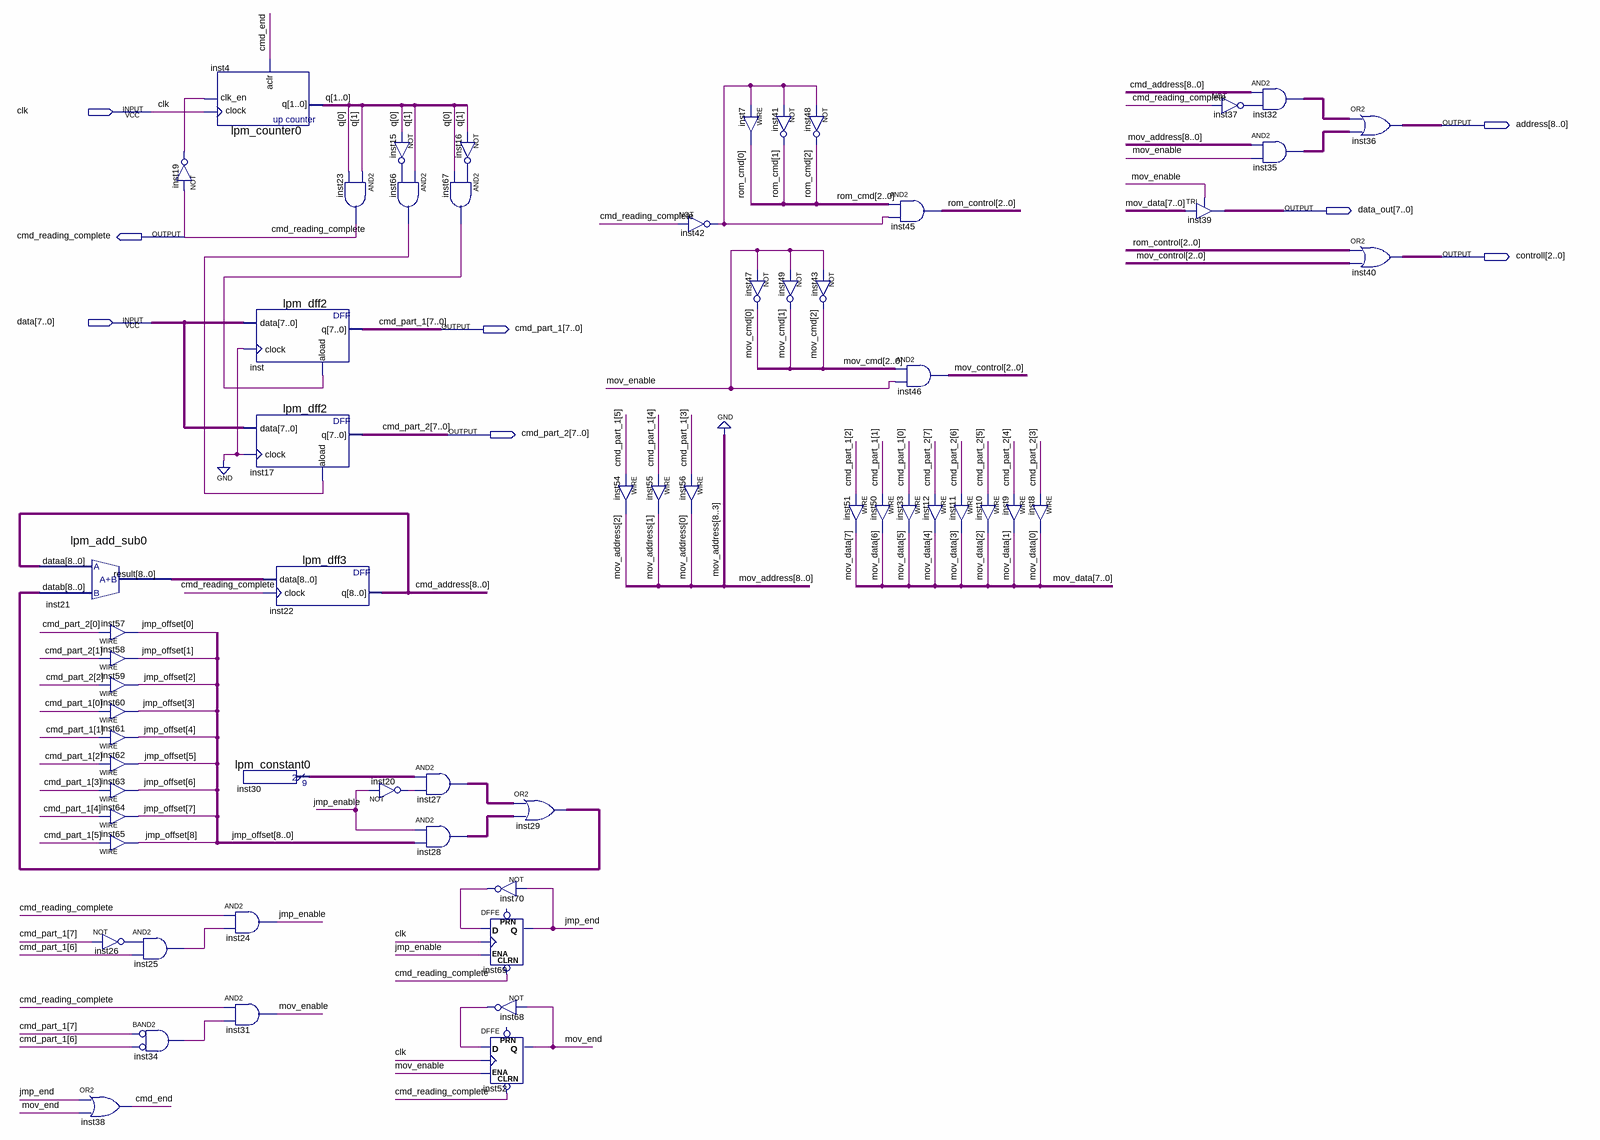
[diagram p0: schematic sheet]
// Quartus schematic ControllUnit.bdf as structural Verilog: 61 symbols, 8 pins
module ControllUnit (
  input  clk,
  input  [7:0] data,
  output [8:0] address,
  output [7:0] data_out,
  output cmd_reading_complete,
  output [2:0] controll,
  output [7:0] cmd_part_1,
  output [7:0] cmd_part_2
);

  wire cmd_end, inst15_out, inst16_out, inst19_out, inst20_out, inst25_out, inst26_out, inst34_out,
       inst37_out, inst42_out, inst66_out, inst67_out, inst68_out, inst70_out, jmp_enable, jmp_end,
       mov_enable, mov_end;
  wire [1:0] q;
  wire [2:0] mov_address, mov_cmd, mov_control, rom_cmd, rom_control;
  wire [7:0] mov_data;
  wire [8:0] cmd_address, inst21_result, inst27_out, inst28_out, inst29_out, inst30_result, inst32_out,
       inst35_out, jmp_offset;

  lpm_add_sub0 inst21 (.dataa(cmd_address), .datab(inst29_out), .result(inst21_result));
  assign jmp_offset[0] = cmd_part_2[0];  // WIRE inst57
  assign jmp_offset[1] = cmd_part_2[1];  // WIRE inst58
  assign jmp_offset[2] = cmd_part_2[2];  // WIRE inst59
  assign jmp_offset[3] = cmd_part_1[0];  // WIRE inst60
  assign jmp_offset[4] = cmd_part_1[1];  // WIRE inst61
  assign jmp_offset[5] = cmd_part_1[2];  // WIRE inst62
  assign jmp_offset[6] = cmd_part_1[3];  // WIRE inst63
  assign jmp_offset[7] = cmd_part_1[4];  // WIRE inst64
  assign jmp_offset[8] = cmd_part_1[5];  // WIRE inst65
  not inst26 (inst26_out, cmd_part_1[7]);
  or inst38 (cmd_end, jmp_end, mov_end);
  not inst19 (inst19_out, cmd_reading_complete);
  and inst25 (inst25_out, inst26_out, cmd_part_1[6]);
  and inst34 (inst34_out, ~cmd_part_1[7], ~cmd_part_1[6]);  // BAND2
  lpm_counter0 inst4 (.clock(clk), .clk_en(inst19_out), .aclr(cmd_end), .q(q));
  and inst24 (jmp_enable, cmd_reading_complete, inst25_out);
  and inst31 (mov_enable, cmd_reading_complete, inst34_out);
  lpm_dff2 inst (.data(data), .clock(1'b0), .aload(inst67_out), .q(cmd_part_1));
  lpm_dff2 inst17 (.data(data), .clock(1'b0), .aload(inst66_out), .q(cmd_part_2));
  lpm_dff3 inst22 (.data(inst21_result), .clock(cmd_reading_complete), .q(cmd_address));
  lpm_constant0 inst30 (.result(inst30_result));
  and inst23 (cmd_reading_complete, q[1], q[0]);
  not inst20 (inst20_out, jmp_enable);
  not inst15 (inst15_out, q[0]);
  and inst66 (inst66_out, q[1], inst15_out);
  assign inst27_out = inst30_result & {9{inst20_out}};  // AND2 inst27, 9 bits wide
  assign inst28_out = {9{jmp_enable}} & jmp_offset;  // AND2 inst28, 9 bits wide
  not inst16 (inst16_out, q[1]);
  and inst67 (inst67_out, inst16_out, q[0]);
  not inst70 (inst70_out, jmp_end);
  DFFE inst69 (.CLRN(cmd_reading_complete), .D(inst70_out), .CLK(clk), .ENA(jmp_enable), .Q(jmp_end));  // open: PRN
  not inst68 (inst68_out, mov_end);
  DFFE inst52 (.CLRN(cmd_reading_complete), .D(inst68_out), .CLK(clk), .ENA(mov_enable), .Q(mov_end));  // open: PRN
  assign inst29_out = inst27_out | inst28_out;  // OR2 inst29, 9 bits wide
  assign mov_address[2] = cmd_part_1[5];  // WIRE inst54
  assign mov_address[1] = cmd_part_1[4];  // WIRE inst55
  not inst42 (inst42_out, cmd_reading_complete);
  assign mov_address[0] = cmd_part_1[3];  // WIRE inst56
  assign rom_cmd[0] = inst42_out;  // WIRE inst7
  not inst47 (mov_cmd[0], mov_enable);
  not inst41 (rom_cmd[1], inst42_out);
  not inst48 (rom_cmd[2], inst42_out);
  not inst49 (mov_cmd[1], mov_enable);
  not inst43 (mov_cmd[2], mov_enable);
  assign mov_data[7] = cmd_part_1[2];  // WIRE inst51
  assign rom_control = rom_cmd & {3{inst42_out}};  // AND2 inst45, 3 bits wide
  assign mov_control = mov_cmd & {3{mov_enable}};  // AND2 inst46, 3 bits wide
  assign mov_data[5] = cmd_part_1[0];  // WIRE inst33
  assign mov_data[6] = cmd_part_1[1];  // WIRE inst50
  assign mov_data[3] = cmd_part_2[6];  // WIRE inst11
  assign mov_data[4] = cmd_part_2[7];  // WIRE inst12
  assign mov_data[1] = cmd_part_2[4];  // WIRE inst9
  assign mov_data[2] = cmd_part_2[5];  // WIRE inst10
  assign mov_data[0] = cmd_part_2[3];  // WIRE inst8
  not inst37 (inst37_out, cmd_reading_complete);
  TRI inst39[7:0] (.IN(mov_data), .OE(mov_enable), .OUT(data_out));
  assign inst32_out = cmd_address & {9{inst37_out}};  // AND2 inst32, 9 bits wide
  assign inst35_out = {{6{1'b0}}, mov_address} & {9{mov_enable}};  // AND2 inst35, 9 bits wide
  assign address = inst32_out | inst35_out;  // OR2 inst36, 9 bits wide
  assign controll = rom_control | mov_control;  // OR2 inst40, 3 bits wide
endmodule
